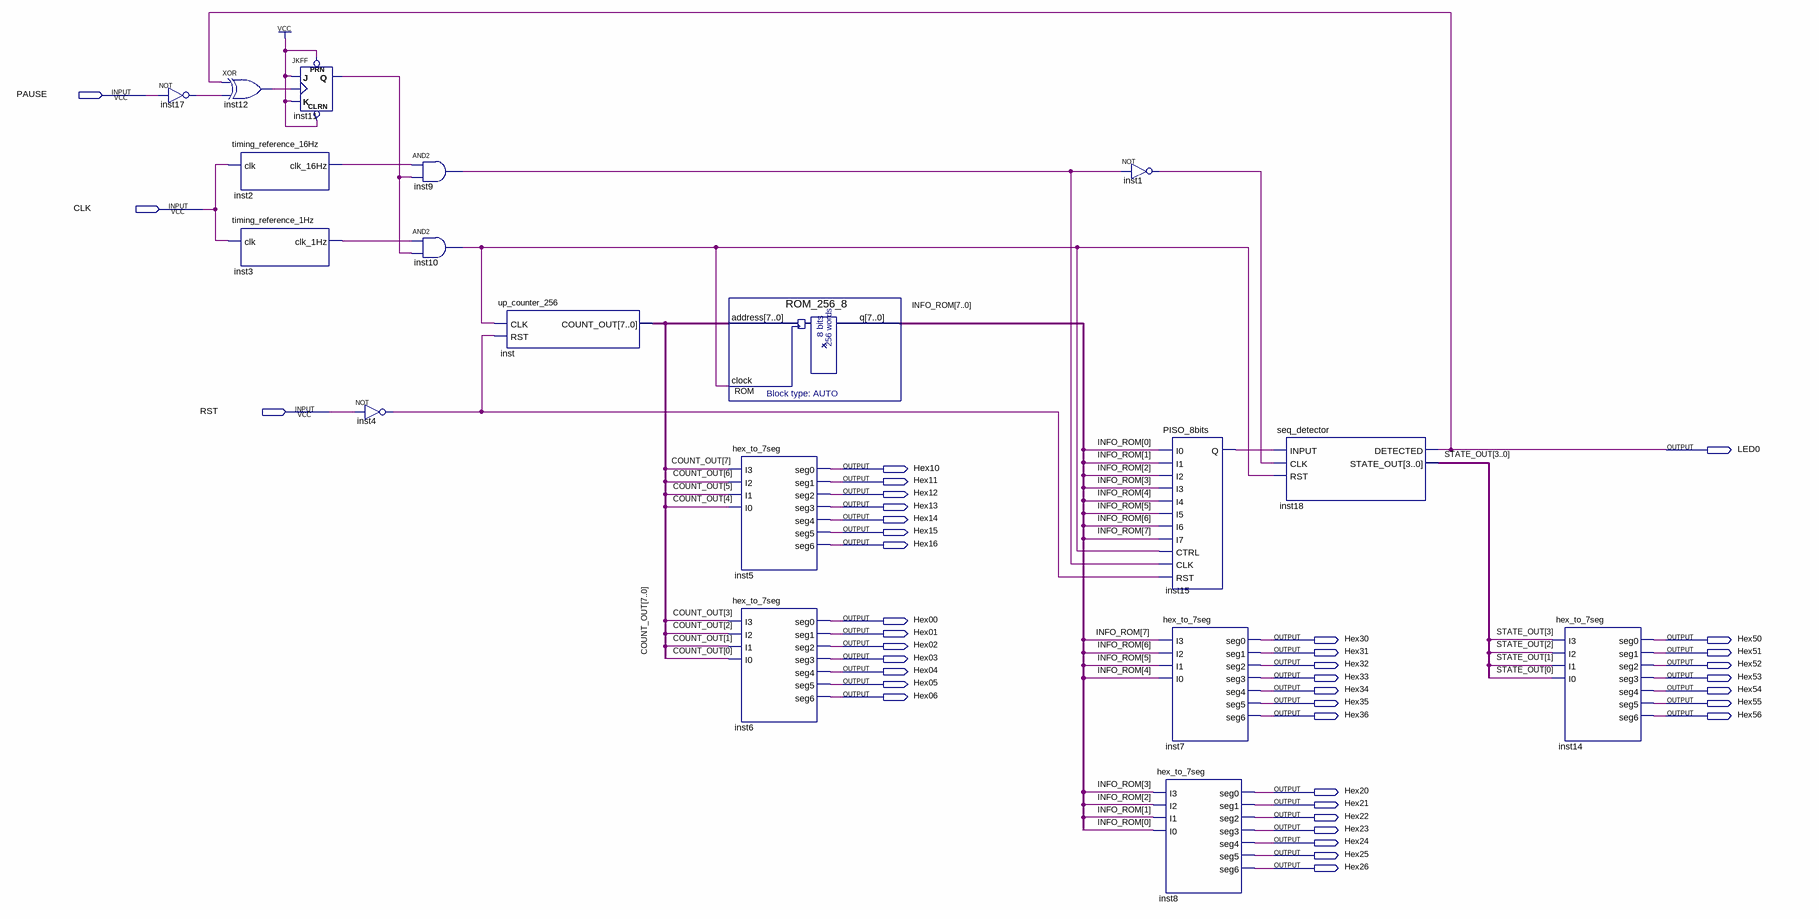
[diagram p0: schematic sheet]
// Quartus schematic lab007.bdf as structural Verilog: 18 symbols, 39 pins
module lab007 (
  input  PAUSE,
  input  CLK,
  input  RST,
  output LED0,
  output Hex10,
  output Hex11,
  output Hex12,
  output Hex13,
  output Hex14,
  output Hex15,
  output Hex16,
  output Hex00,
  output Hex01,
  output Hex30,
  output Hex50,
  output Hex02,
  output Hex31,
  output Hex51,
  output Hex03,
  output Hex32,
  output Hex52,
  output Hex04,
  output Hex33,
  output Hex53,
  output Hex05,
  output Hex34,
  output Hex54,
  output Hex06,
  output Hex35,
  output Hex55,
  output Hex36,
  output Hex56,
  output Hex20,
  output Hex21,
  output Hex22,
  output Hex23,
  output Hex24,
  output Hex25,
  output Hex26
);

  wire inst1_out, inst2_clk_16hz, inst3_clk_1hz, inst4_out, inst9_out, inst10_out, inst11_q, inst12_out,
       inst15_q, inst17_out;
  wire [3:0] STATE_OUT;
  wire [7:0] COUNT_OUT, INFO_ROM;

  not inst17 (inst17_out, PAUSE);
  xor inst12 (inst12_out, LED0, inst17_out);
  timing_reference_16Hz inst2 (.clk(CLK), .clk_16Hz(inst2_clk_16hz));
  timing_reference_1Hz inst3 (.clk(CLK), .clk_1Hz(inst3_clk_1hz));
  JKFF inst11 (.PRN(1'b1), .CLRN(1'b1), .K(1'b1), .J(1'b1), .CLK(inst12_out), .Q(inst11_q));
  not inst4 (inst4_out, RST);
  and inst9 (inst9_out, inst2_clk_16hz, inst11_q);
  and inst10 (inst10_out, inst3_clk_1hz, inst11_q);
  up_counter_256 inst (.CLK(inst10_out), .RST(inst4_out), .COUNT_OUT(COUNT_OUT));
  ROM_256_8 ROM (.address(COUNT_OUT), .clock(inst10_out), .q(INFO_ROM));
  hex_to_7seg inst5 (
    .I3(COUNT_OUT[7]), .I2(COUNT_OUT[6]), .I1(COUNT_OUT[5]), .I0(COUNT_OUT[4]), .seg0(Hex10), .seg1(Hex11),
    .seg2(Hex12), .seg3(Hex13), .seg4(Hex14), .seg5(Hex15), .seg6(Hex16));
  hex_to_7seg inst6 (
    .I3(COUNT_OUT[3]), .I2(COUNT_OUT[2]), .I1(COUNT_OUT[1]), .I0(COUNT_OUT[0]), .seg0(Hex00), .seg1(Hex01),
    .seg2(Hex02), .seg3(Hex03), .seg4(Hex04), .seg5(Hex05), .seg6(Hex06));
  not inst1 (inst1_out, inst9_out);
  PISO_8bits inst15 (
    .I0(INFO_ROM[0]), .I1(INFO_ROM[1]), .I2(INFO_ROM[2]), .I3(INFO_ROM[3]), .I4(INFO_ROM[4]),
    .I5(INFO_ROM[5]), .I6(INFO_ROM[6]), .I7(INFO_ROM[7]), .CTRL(inst10_out), .CLK(inst9_out),
    .RST(inst4_out), .Q(inst15_q));
  hex_to_7seg inst7 (
    .I3(INFO_ROM[7]), .I2(INFO_ROM[6]), .I1(INFO_ROM[5]), .I0(INFO_ROM[4]), .seg0(Hex30), .seg1(Hex31),
    .seg2(Hex32), .seg3(Hex33), .seg4(Hex34), .seg5(Hex35), .seg6(Hex36));
  hex_to_7seg inst8 (
    .I3(INFO_ROM[3]), .I2(INFO_ROM[2]), .I1(INFO_ROM[1]), .I0(INFO_ROM[0]), .seg0(Hex20), .seg1(Hex21),
    .seg2(Hex22), .seg3(Hex23), .seg4(Hex24), .seg5(Hex25), .seg6(Hex26));
  seq_detector inst18 (.INPUT(inst15_q), .CLK(inst1_out), .RST(inst10_out), .DETECTED(LED0), .STATE_OUT(STATE_OUT));
  hex_to_7seg inst14 (
    .I3(STATE_OUT[3]), .I2(STATE_OUT[2]), .I1(STATE_OUT[1]), .I0(STATE_OUT[0]), .seg0(Hex50), .seg1(Hex51),
    .seg2(Hex52), .seg3(Hex53), .seg4(Hex54), .seg5(Hex55), .seg6(Hex56));
endmodule
